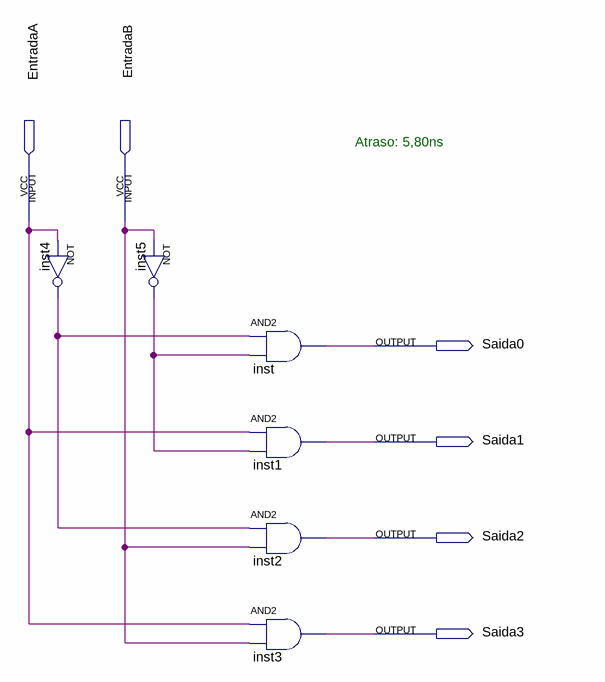
[diagram p0: schematic sheet]
// Quartus schematic Decoder2to4.bdf as structural Verilog: 6 symbols, 6 pins
module Decoder2to4 (
  input  EntradaA,
  input  EntradaB,
  output Saida0,
  output Saida1,
  output Saida2,
  output Saida3
);

  wire inst4_out, inst5_out;

  not inst4 (inst4_out, EntradaA);
  not inst5 (inst5_out, EntradaB);
  and inst (Saida0, inst4_out, inst5_out);
  and inst1 (Saida1, EntradaA, inst5_out);
  and inst2 (Saida2, inst4_out, EntradaB);
  and inst3 (Saida3, EntradaA, EntradaB);

  // Notes on the sheet:
  //   Atraso: 5,80ns
endmodule
